# Altium project X98_CARRIER_V1R2.PrjPcb (part 1 of 3)
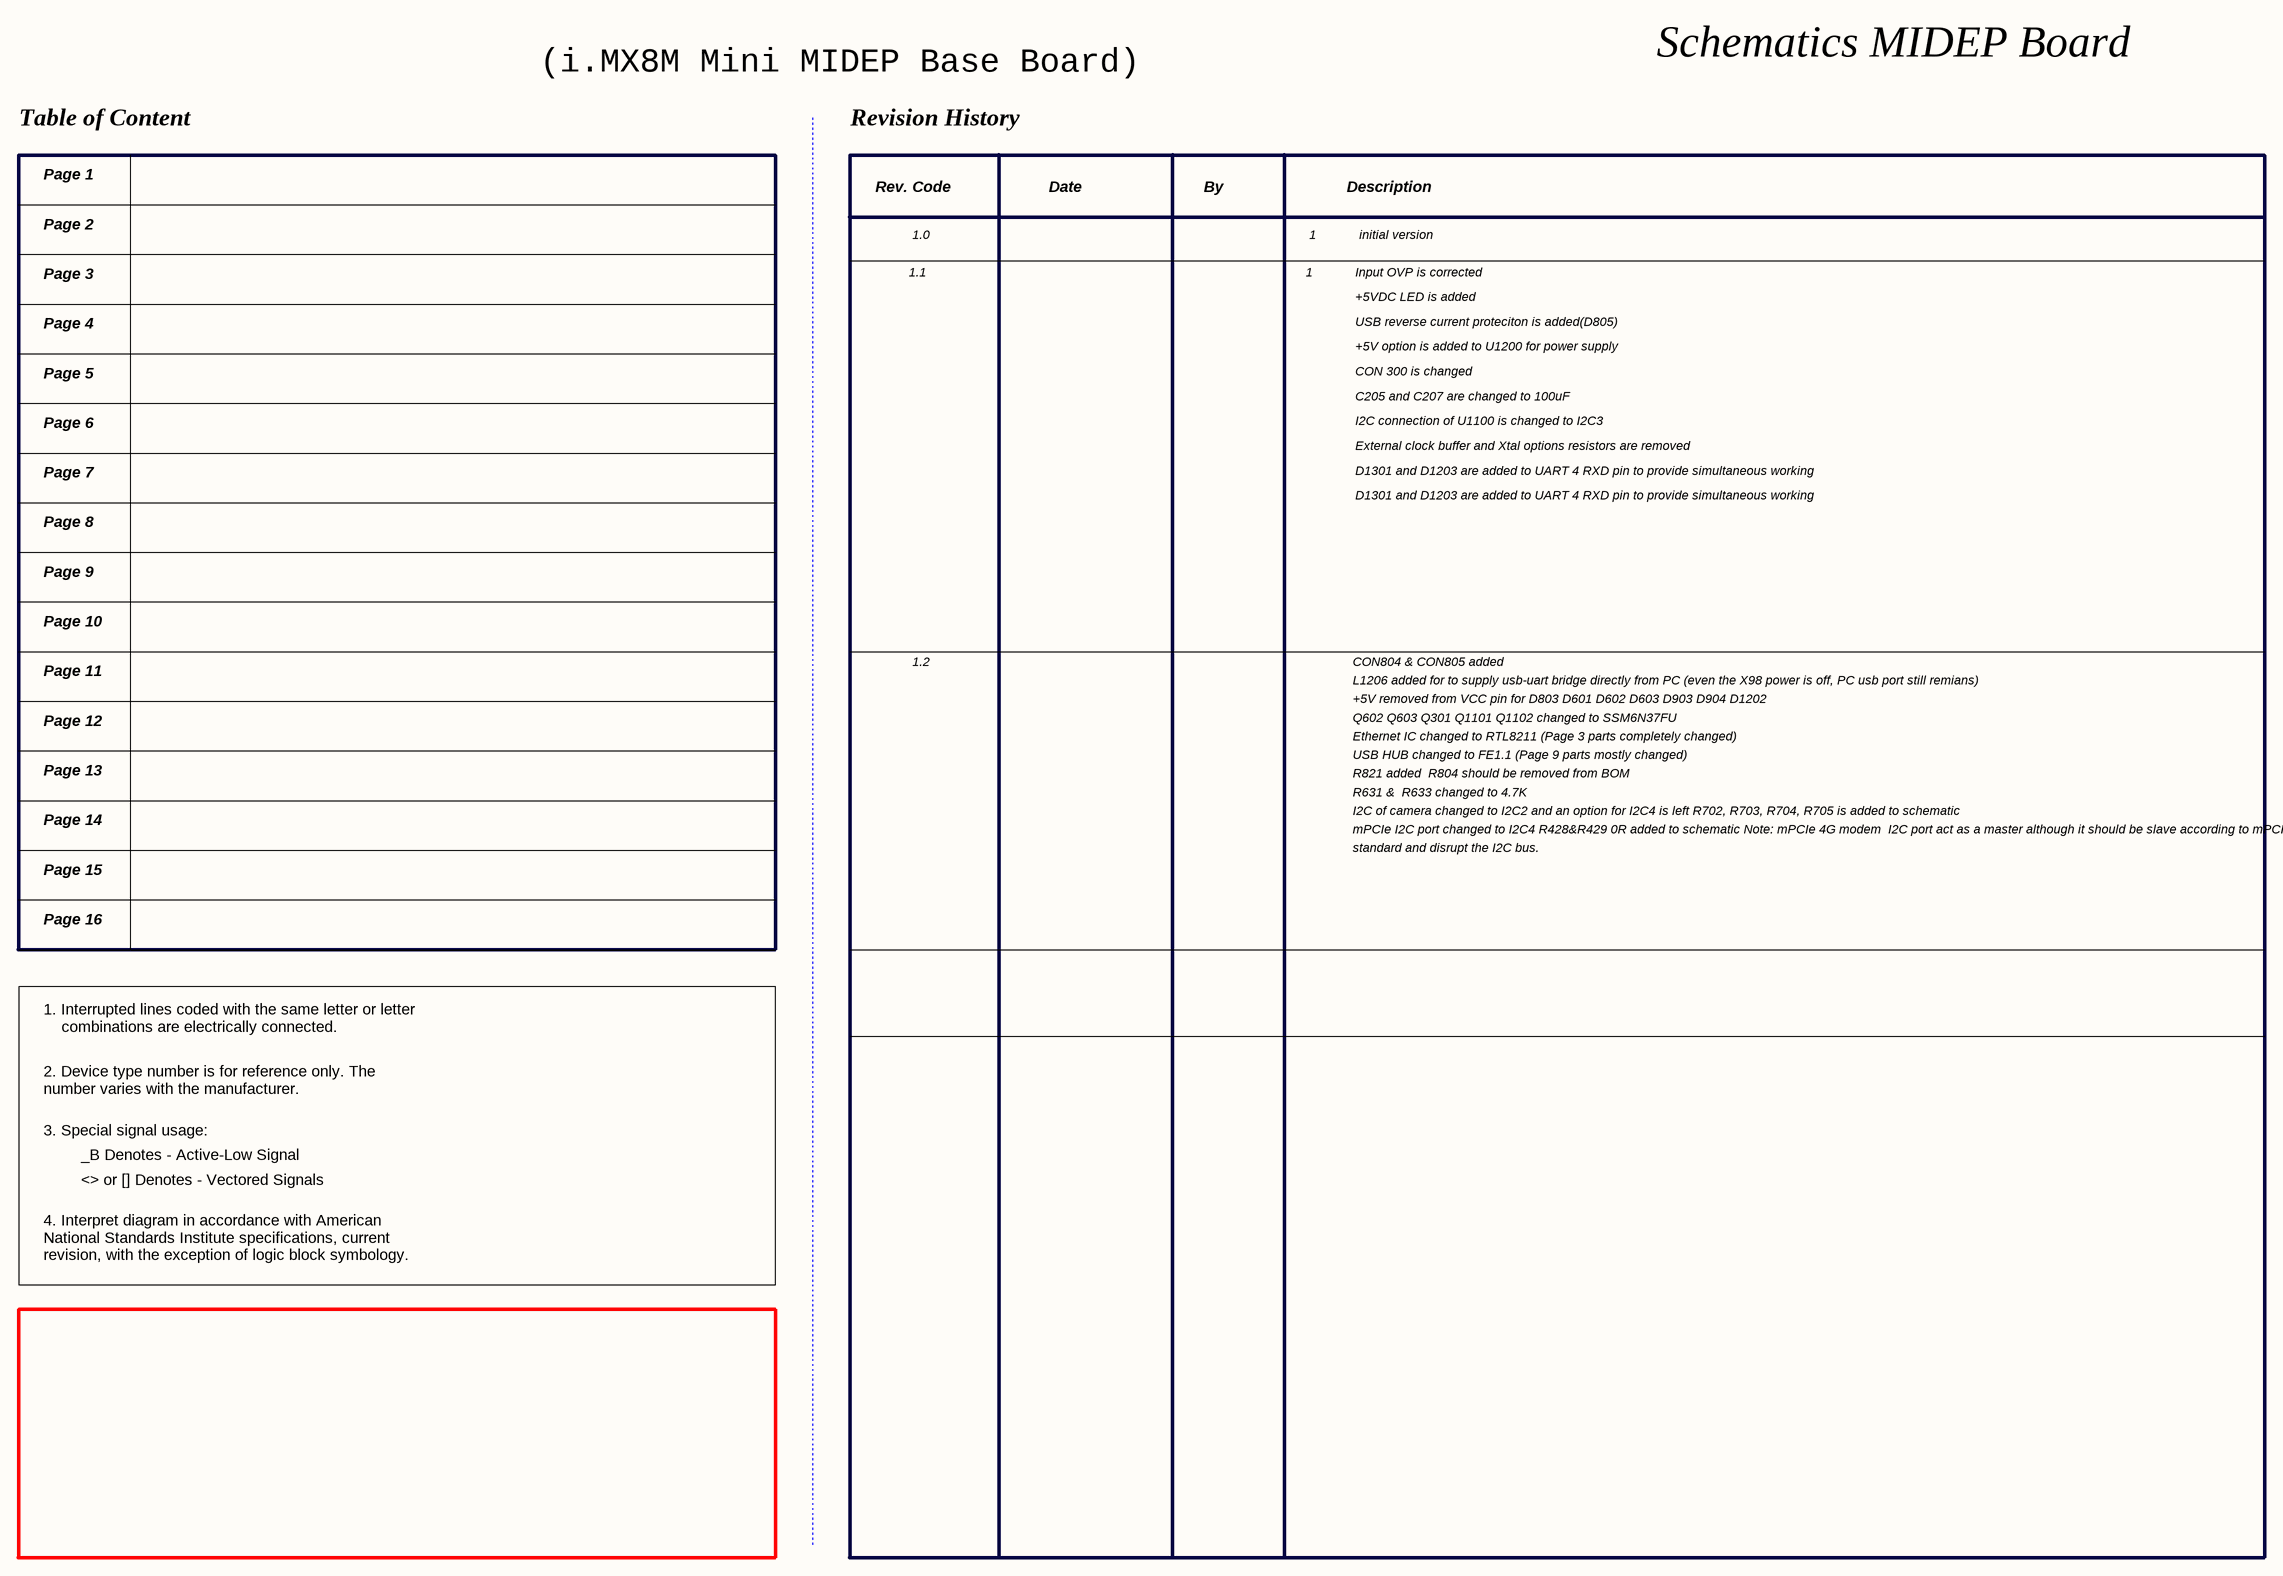
[diagram p0: 00 COVER.SchDoc]
13 sheets, 358 parts. Net scope: global (net labels, ports and power ports of the same name join across sheets).
Board file: X98_CARRIER_V1R2_12082022.PcbDoc
Sheets:
  00 COVER.SchDoc
  00 BLOCK DIAGRAM.SchDoc
  MAIN.SchDoc
    U_05 MICROSD = 05 MICROSD.SchDoc
    U_06 MIPI-DSI to HDMI = 06 MIPI-DSI to HDMI.SchDoc
    U_07 MIPI CSI = 07 MIPI CSI.SchDoc
    U_08 USB OTG & POWER = 08 USB OTG & POWER.SchDoc
    U_09 USB HUB = 09 USB HUB.SchDoc
    U_10 BOOT = 10 BOOT.SchDoc
    U_11 EXPANSION CN = 11 EXPANSION CN.SchDoc
    U_12 CONSOLE = 12 CONSOLE.SchDoc
    U_01 SoM IO INTERFACE = 01 SoM IO INTERFACE.SchDoc
  00 PCB SPEC.SchDoc

## Sheet 00 COVER.SchDoc
size A2

### Notes on the sheet
- (i.MX8M Mini MIDEP Base Board)
- Schematics MIDEP Board
- Table of Content
- Revision History
- Page 1
- Rev. Code
- Date
- By
- Description
- Page 2
- 1.0
- 1
- initial version
- Page 3
- Page 4
- 1.1
- Input OVP is corrected
- +5VDC LED is added
- USB reverse current proteciton is added(D805)
- Page 5
- +5V option is added to U1200 for power supply
- CON 300 is changed
- Page 6
- C205 and C207 are changed to 100uF
- I2C connection of U1100 is changed to I2C3
- External clock buffer and Xtal options resistors are removed
- Page 7
- D1301 and D1203 are added to UART 4 RXD pin to provide simultaneous working
- Page 8
- Page 9
- Page 10
- Page 11
- 1.2
- CON804 & CON805 added
- L1206 added for to supply usb-uart bridge directly from PC (even the X98 power is off, PC usb port still remians)
- +5V removed from VCC pin for D803 D601 D602 D603 D903 D904 D1202
- Page 12
- Q602 Q603 Q301 Q1101 Q1102 changed to SSM6N37FU
- Ethernet IC changed to RTL8211 (Page 3 parts completely changed)
- USB HUB changed to FE1.1 (Page 9 parts mostly changed)
- Page 13
- Page 14
- R821 added  R804 should be removed from BOM
- R631 &  R633 changed to 4.7K
- I2C of camera changed to I2C2 and an option for I2C4 is left R702, R703, R704, R705 is added to schematic
- Page 15
- mPCIe I2C port changed to I2C4 R428&R429 0R added to schematic Note: mPCIe 4G modem  I2C port act as a master although it should be slave according to mPCIe
- standard and disrupt the I2C bus.
- Page 16
- 1. Interrupted lines coded with the same letter or letter
  combinations are electrically connected.
- 2. Device type number is for reference only. The
  number varies with the manufacturer.
- 3. Special signal usage:
- _B Denotes - Active-Low Signal
- <> or [] Denotes - Vectored Signals
- 4. Interpret diagram in accordance with American
  National Standards Institute specifications, current
  revision, with the exception of logic block symbology.
- Sheet Title:
- Project:
- Inventron
- Electronics and Software
- Size:
- Date:
- Drawn By:
- Revision:
- Checked By:
- A4
- Sheet
- Time:
- of
- Budotek Teknopark
- Dudullu OSB
- Des 2. Cadde No:8/30
- ©2020 Inventron Electronics and Software. All rights reserved.
- Umraniye / ISTANBUL

## Sheet 00 BLOCK DIAGRAM.SchDoc
size A3
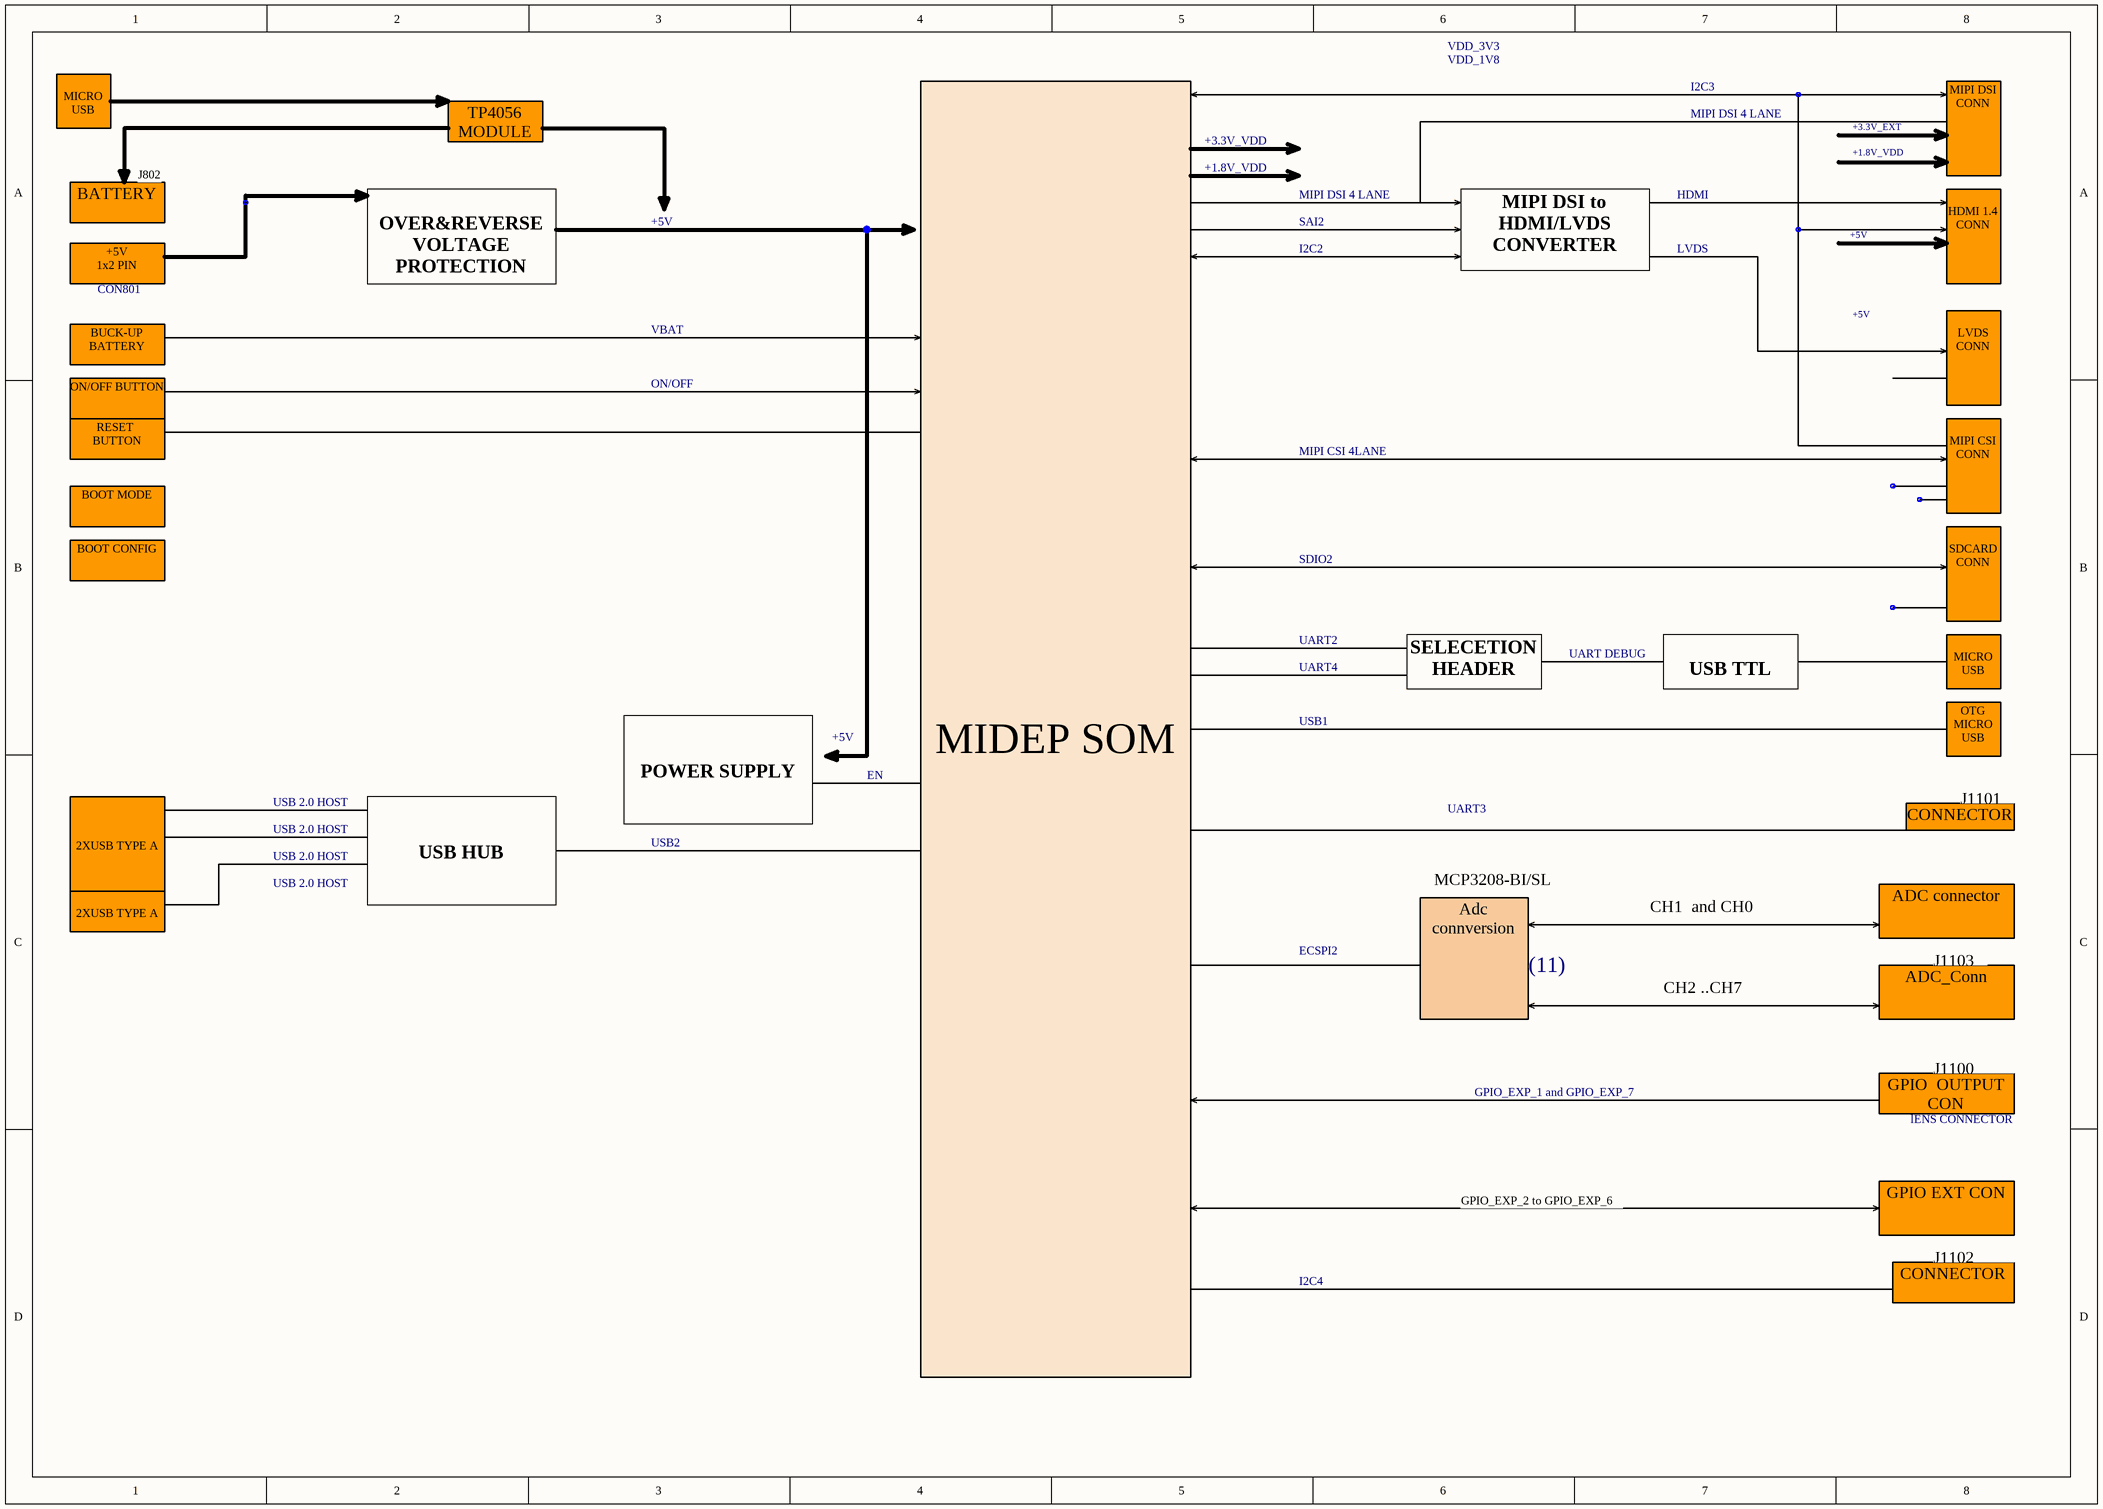
[diagram p1: 00 BLOCK DIAGRAM.SchDoc]

### Notes on the sheet
- VDD_3V3
- VDD_1V8
- I2C3
- MICRO USB
- J802
- TP4056
  MODULE
- +3.3V_VDD
- +1.8V_VDD
- MIPI DSI 4 LANE
- +3.3V_EXT
- MIPI DSI CONN
- BATTERY
- +5V
- SAI2
- HDMI
- +5V
  1x2 PIN
- CON801
- OVER&REVERSE VOLTAGE
  PROTECTION
- I2C2
- MIPI DSI to HDMI/LVDS CONVERTER
- LVDS
- HDMI 1.4 CONN
- BUCK-UP BATTERY
- VBAT
- ON/OFF BUTTON
- ON/OFF
- LVDS CONN
- RESET
  BUTTON
- MIPI CSI 4LANE
- MIPI CSI CONN
- BOOT MODE
- BOOT CONFIG
- SDIO2
- UART2
- SDCARD CONN
- UART4
- SELECETION HEADER
- UART DEBUG
- USB TTL
- EN
- USB1
- OTG
  MICRO USB
- USB 2.0 HOST
- POWER SUPPLY
- USB2
- UART3
- CONNECTOR
- J1101
- 2XUSB TYPE A
- USB HUB
- MCP3208-BI/SL
- CH1  and CH0
- ECSPI2
- (11)
- CH2 ..CH7
- ADC connector
- J1103
- Adc connversion
- ADC_Conn
- GPIO_EXP_1 and GPIO_EXP_7
- GPIO  OUTPUT CON
- lENS CONNECTOR
- J1100
- GPIO_EXP_2 to GPIO_EXP_6
- GPIO EXT CON
- J1102
- I2C4
- MIDEP SOM
- Sheet Title:
- Inventron
- Size:
- Drawn By:
- Revision:
- Project:
- Checked By:
- A4
- Sheet
- of
- Budotek Teknopark
- Dudullu OSB
- Des 2. Cadde No:8/30
- Umraniye / ISTANBUL
- Electronics and Software
- Date:
- Time:
- ©2020 Inventron Electronics and Software. All rights reserved.

## Sheet MAIN.SchDoc
size A3
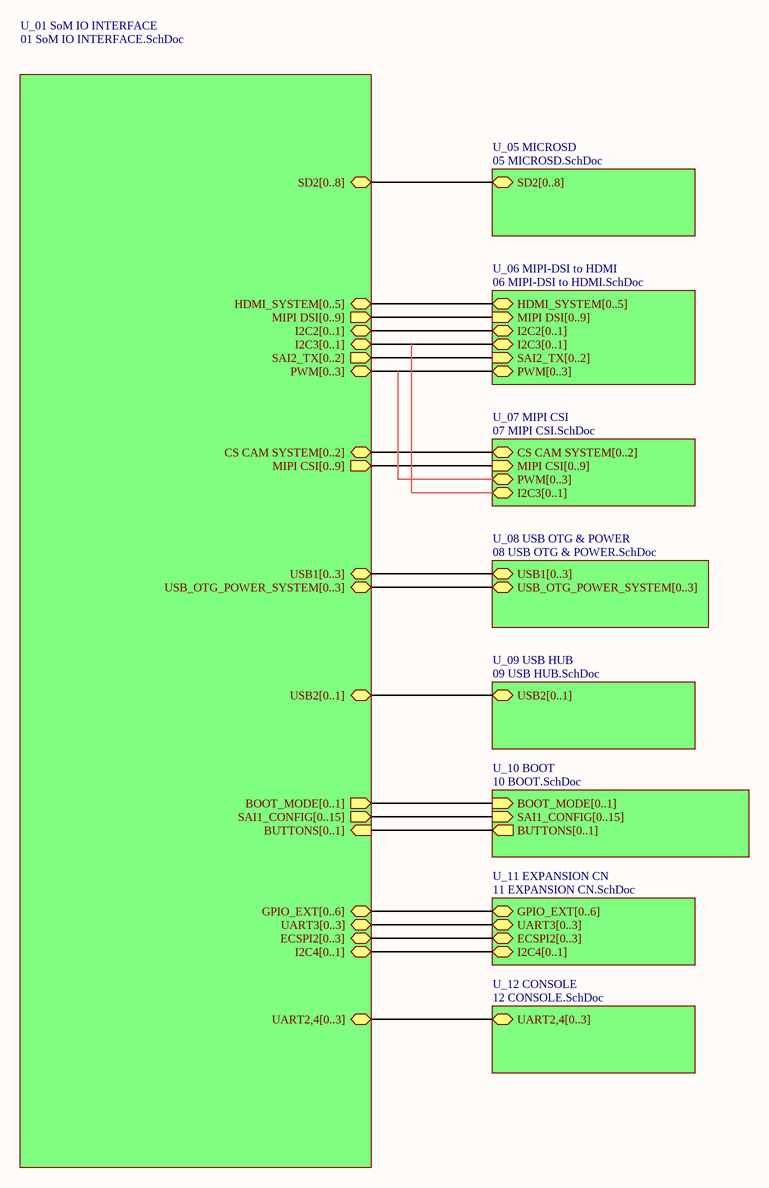
[diagram p2: MAIN.SchDoc]

### Sub-sheets
U_01 SoM IO INTERFACE = 01 SoM IO INTERFACE.SchDoc: MIPI DSI[0..9] (out), MIPI CSI[0..9] (out), USB1[0..3] (bidir), USB2[0..1] (bidir), UART3[0..3] (bidir), ECSPI2[0..3] (bidir), I2C2[0..1] (bidir), I2C3[0..1] (bidir), I2C4[0..1] (bidir), SD2[0..8] (bidir), PWM[0..3] (bidir), GPIO_EXT[0..6] (bidir), SAI1_CONFIG[0..15] (out), BUTTONS[0..1] (in), CS CAM SYSTEM[0..2] (bidir), USB_OTG_POWER_SYSTEM[0..3] (bidir), HDMI_SYSTEM[0..5] (bidir), BOOT_MODE[0..1] (out), UART2,4[0..3] (bidir), SAI2_TX[0..2] (out)
U_05 MICROSD = 05 MICROSD.SchDoc: SD2[0..8] (bidir)
U_06 MIPI-DSI to HDMI = 06 MIPI-DSI to HDMI.SchDoc: HDMI_SYSTEM[0..5] (bidir), MIPI DSI[0..9] (in), I2C2[0..1] (bidir), I2C3[0..1] (bidir), SAI2_TX[0..2] (in), PWM[0..3] (bidir)
U_07 MIPI CSI = 07 MIPI CSI.SchDoc: CS CAM SYSTEM[0..2] (bidir), MIPI CSI[0..9] (in), PWM[0..3] (bidir), I2C3[0..1] (bidir)
U_08 USB OTG & POWER = 08 USB OTG & POWER.SchDoc: USB1[0..3] (bidir), USB_OTG_POWER_SYSTEM[0..3] (bidir)
U_09 USB HUB = 09 USB HUB.SchDoc: USB2[0..1] (bidir)
U_10 BOOT = 10 BOOT.SchDoc: BUTTONS[0..1] (out), BOOT_MODE[0..1] (in), SAI1_CONFIG[0..15] (in)
U_11 EXPANSION CN = 11 EXPANSION CN.SchDoc: GPIO_EXT[0..6] (bidir), UART3[0..3] (bidir), ECSPI2[0..3] (bidir), I2C4[0..1] (bidir)
U_12 CONSOLE = 12 CONSOLE.SchDoc: UART2,4[0..3] (bidir)

### Notes on the sheet
- Sheet Title:
- Inventron
- Size:
- Drawn By:
- Revision:
- Project:
- Checked By:
- A4
- Sheet
- of
- Budotek Teknopark
- Dudullu OSB
- Des 2. Cadde No:8/30
- Umraniye / ISTANBUL
- Electronics and Software
- Date:
- Time:
- ©2020 Inventron Electronics and Software. All rights reserved.

## Sheet 05 MICROSD.SchDoc
size A4
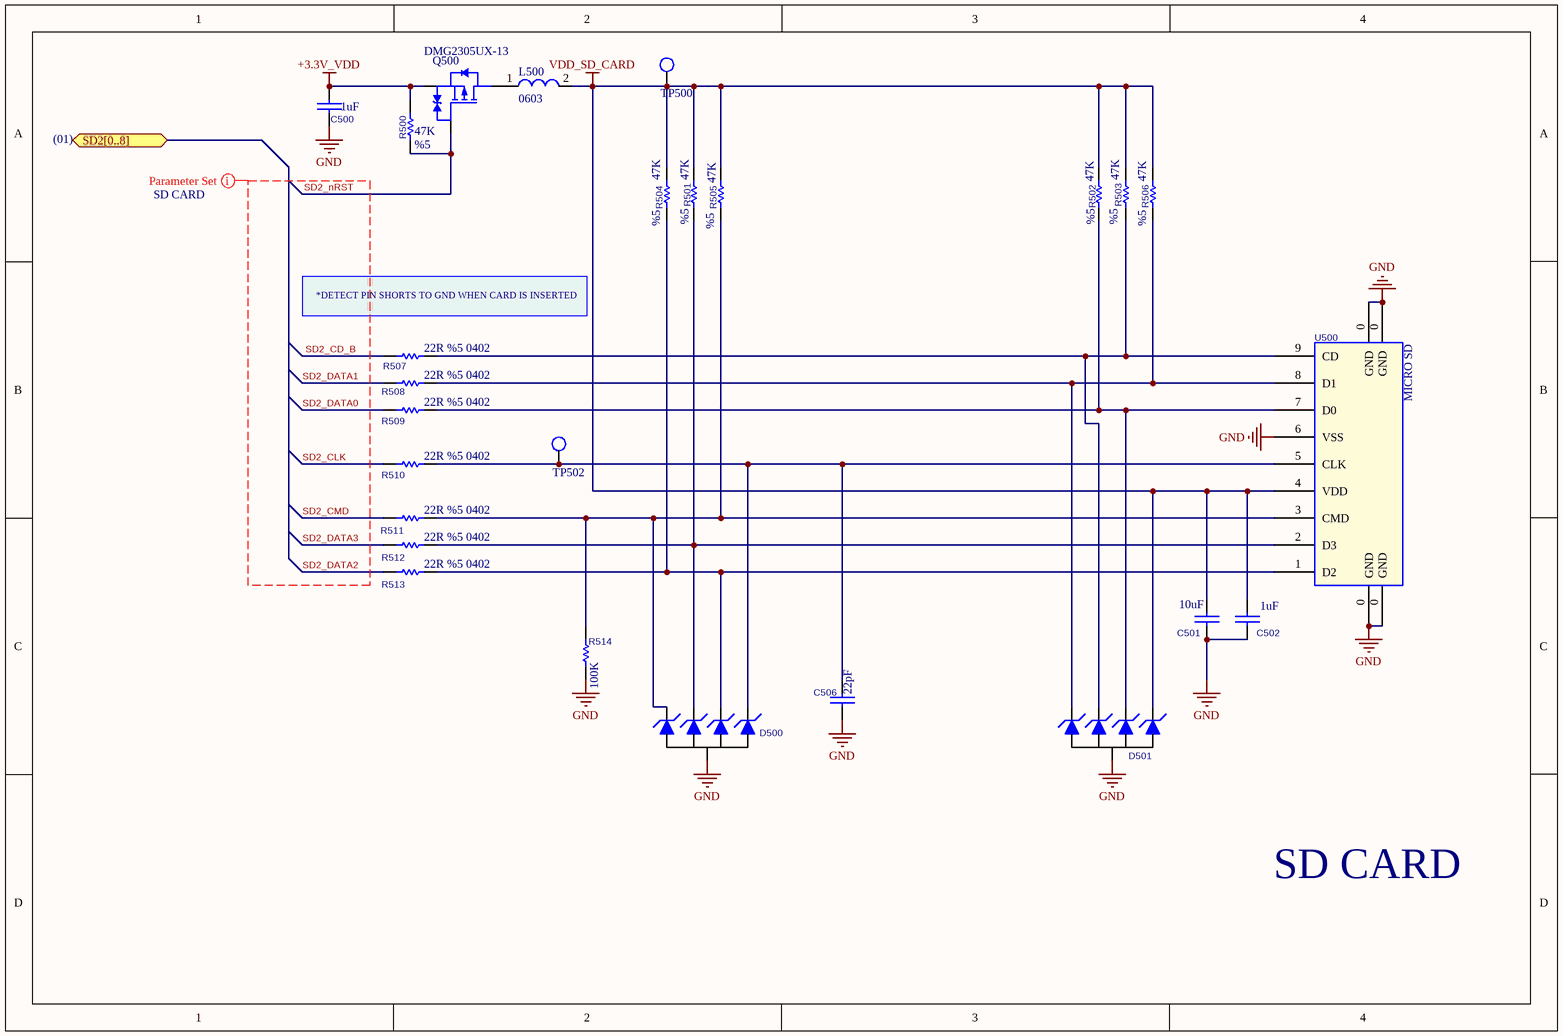
[diagram p3: 05 MICROSD.SchDoc]

### Parts
C500  1uF  [0603_CC]
C501  10uF  [0603_CC]
C502  1uF  [0603_CC]
C506  22pF  [0402_CC]
D500  DIODE-DF5A6.2LJE,LM  [DF5A6.2LJE,LM]  (value not drawn)
D501  DIODE-DF5A6.2LJE,LM  [DF5A6.2LJE,LM]  (value not drawn)
L500  0603  [0603_RES]
Q500  DMG2305UX-13  [SOT23]
R500  47K  Tolerance: %5  [0402_RES]
R501  47K  Tolerance: %5  [0402_RES]
R502  47K  Tolerance: %5  [0402_RES]
R503  47K  Tolerance: %5  [0402_RES]
R504  47K  Tolerance: %5  [0402_RES]
R505  47K  Tolerance: %5  [0402_RES]
R506  47K  Tolerance: %5  [0402_RES]
R507  22R %5 0402  [0402_RES]
R508  22R %5 0402  [0402_RES]
R509  22R %5 0402  [0402_RES]
R510  22R %5 0402  [0402_RES]
R511  22R %5 0402  [0402_RES]
R512  22R %5 0402  [0402_RES]
R513  22R %5 0402  [0402_RES]
R514  100K  [0402_RES]
TP500  TEST POINT 15  [testpoint_15]  (value not drawn)  (no BOM)
TP502  TEST POINT 15  [testpoint_15]  (value not drawn)  (no BOM)
U500  MICRO SD  [L-KLS1-TF-003-H1.85-R]

### Ports
SD2[0..8] (bidir)

### Nets
+3.3V_VDD: C500.1 Q500.2(S) R500.2
GND: C500.2 C501.2 C502.2 C506.2 D500.2 D501.2 R514.1 U500.0(GND) U500.6(VSS)
VDD_SD_CARD: C501.1 C502.1 D501.5 L500.2 R501.2 R502.2 R503.2 R504.2 R505.2 R506.2 TP500.1 U500.4(VDD)
SD2_CD_B: R507.1
SD2_CLK: R510.1
SD2_CMD: R511.1
SD2_DATA0: R509.1
SD2_DATA1: R508.1
SD2_DATA2: R513.1
SD2_DATA3: R512.1
SD2_nRST: Q500.1(G) R500.1
NetC506_1: C506.1 D500.5 R510.2 TP502.1 U500.5(CLK)
NetD500_1: D500.1 R505.1 R511.2 R514.2 U500.3(CMD)
NetD500_3: D500.3 R501.1 R512.2 U500.2(D3)
NetD500_4: D500.4 R504.1 R513.2 U500.1(D2)
NetD501_1: D501.1 R506.1 R508.2 U500.8(D1)
NetD501_3: D501.3 R503.1 R507.2 U500.9(CD)
NetD501_4: D501.4 R502.1 R509.2 U500.7(D0)
NetL500_1: L500.1 Q500.3(D)

### Layout directives
net class SD CARD: SD2_CD_B, SD2_CLK, SD2_CMD, SD2_DATA0, SD2_DATA1, SD2_DATA2, SD2_DATA3, SD2_nRST

### Notes on the sheet
- (01)
- *DETECT PIN SHORTS TO GND WHEN CARD IS INSERTED
- SD CARD
- Sheet Title:
- Inventron
- Size:
- Drawn By:
- Revision:
- Project:
- Checked By:
- A4
- Sheet
- of
- Budotek Teknopark
- Dudullu OSB
- Des 2. Cadde No:8/30
- Umraniye / ISTANBUL
- Electronics and Software
- Date:
- Time:
- ©2020 Inventron Electronics and Software. All rights reserved.

### Library data of the parts
C500 C502 = CAP-CL10B105KA8NNNC: CAP CER 1UF 25V X7R 0603; Manufacturer-1: SAMSUNG; Class: Capacitor; Manufacturer Part Number-1: CL10B105KA8NNNC; Footprint: *; Manufacturer-2: *; Manufacturer Part Number-2: *; Inventron Stock No: *; Created By: LA; Created Date: *; Checked By: *; ASSY_OPT: *; Dimensions: *; Unit Price: *; Revision Date/Note: *; Price Break: *; Opt. Temp.: *; Features: *
C501 = CAP-JMK107BC6106MA-T: CAP CER 10UF 6.3V X6S 0603; Manufacturer-1: TAIYO YUDEN; Opt. Temp.: -55/+105; Class: Capacitor; Manufacturer Part Number-1: JMK107BC6106MA-T; Footprint: 0603; Manufacturer-2: *; Manufacturer Part Number-2: *; Inventron Stock No: *; Created By: LA; Created Date: 23.11.2018; Checked By: *; ASSY_OPT: *; Dimensions: *; Unit Price: 0,044; Revision Date/Note: *; Price Break: 4K
C506 = CAP-C0402C220K5GACTU: CAP CER 22PF 50V C0G/NPO 0402; Manufacturer-1: KEMET; Opt. Temp.: -55/+125; Class: Capacitor; Manufacturer Part Number-1: C0402C220K5GACTU; Footprint: 0402; Manufacturer-2: *; Manufacturer Part Number-2: *; Inventron Stock No: *; Created By: LA; Created Date: 23.11.2018; Checked By: *; ASSY_OPT: *; Dimensions: *; Unit Price: 0,00420; Revision Date/Note: *; Price Break: 10K
D500 D501 = DIODE-DF5A6.2LJE,LM: TVS DIODE 5V 4CH SOT-553; Manufacturer-1: TOSHIBA; Manufacturer Part Number-1: DF5A6.2LJE,LM; Footprint: *; Manufacturer-2: *; Manufacturer Part Number-2: *; Inventron Stock No: *; Created By: OKS; Created Date: 29.03.2019; Checked By: *; ASSY_OPT: *; Dimensions: *; Unit Price: *; Revision Date/Note: *; Price Break: *; Opt. Temp.: *; Class: Diode
L500 = IND-FERRITE (RES 0 OHM) 0603: 0OHM 0603; Manufacturer Part Number-1: RC0603JR-070RL; Manufacturer-1: YAGEO; Class: Inductor; Footprint: 0603; Manufacturer-2: *; Inventron Stock No: *; Created By: EE; Checked By: *; ASSY_OPT: *; Dimensions: *; Revision Date/Note: *
Q500 = MOS-DMG2305UX-13: MOSFET P-CH 20V 4.2A SOT23; Manufacturer-1: Diodes Incorporated; Class: Transistor; Manufacturer Part Number-1: DMG2305UX-13; Manufacturer-2: *; Manufacturer Part Number-2: *; Inventron Stock No: *; Created By: EE; Created Date: *; Checked By: *; ASSY_OPT: *; Dimensions: *; Unit Price: 0.072D; Revision Date/Note: *; Price Break: *; Opt. Temp.: *; Features: *
R500-R506 = RES-47K: RES 47K OHM 5% 1/16W 0402; Manufacturer Part Number-1: MCR01MZPJ473; Opt. Temp.: -55/+155; Class: Resistor; Footprint: 0402; Manufacturer-2: *; Manufacturer Part Number-2: *; Inventron Stock No: *; Created By: LA; Checked By: *; ASSY_OPT: *; Dimensions: *; Revision Date/Note: *
R507-R513 = RES- RC0402JR-0722RL.: RES, THICK FILM, 22R, 5%, 0.0625W, 0402, REEL; Manufacturer-1: YAGEO; Class: Resistor; Manufacturer Part Number-1: RC0402JR-0722RL.; Footprint: 0402; Manufacturer-2: *; Manufacturer Part Number-2: *; Inventron Stock No: *; Created By: E.E; Created Date: 22.10.2020; Checked By: *; ASSY_OPT: *; Dimensions: *; Unit Price: *; Revision Date/Note: *; Price Break: *; Opt. Temp.: *; Tolerance: *
R514 = RES-RMCF0402JT100K: RES 100K OHM 5% 1/16W 0402; Manufacturer-1: STACKPOLE; Opt. Temp.: -55/+155; Class: Resistor; Tolerance: %5; Manufacturer Part Number-1: RMCF0402JT100K; Footprint: 0402; Manufacturer-2: *; Manufacturer Part Number-2: *; Inventron Stock No: *; Created By: LA; Created Date: 23.11.2018; Checked By: *; ASSY_OPT: *; Dimensions: *; Unit Price: 0,00127; Revision Date/Note: *; Price Break: 10K; Features: AUTOMOTIVE
U500 = CON-L-KLS1-TF-003-H1.85-R: CONECTOR MICRO SD CARD SMD KLS; Opt. Temp.: -25/+90; Class: Connector; Manufacturer Part Number-1: L-KLS1-TF-003-H1.85-R; Footprint: *; Manufacturer-1: KLS; Manufacturer-2: *; Manufacturer Part Number-2: *; Inventron Stock No: *; Created By: LA; Created Date: 19.04.2019; Checked By: *; ASSY_OPT: *; Dimensions: *; Unit Price: 0,2299; Revision Date/Note: *; Price Break: 1000

## Sheet 06 MIPI-DSI to HDMI.SchDoc
size A2
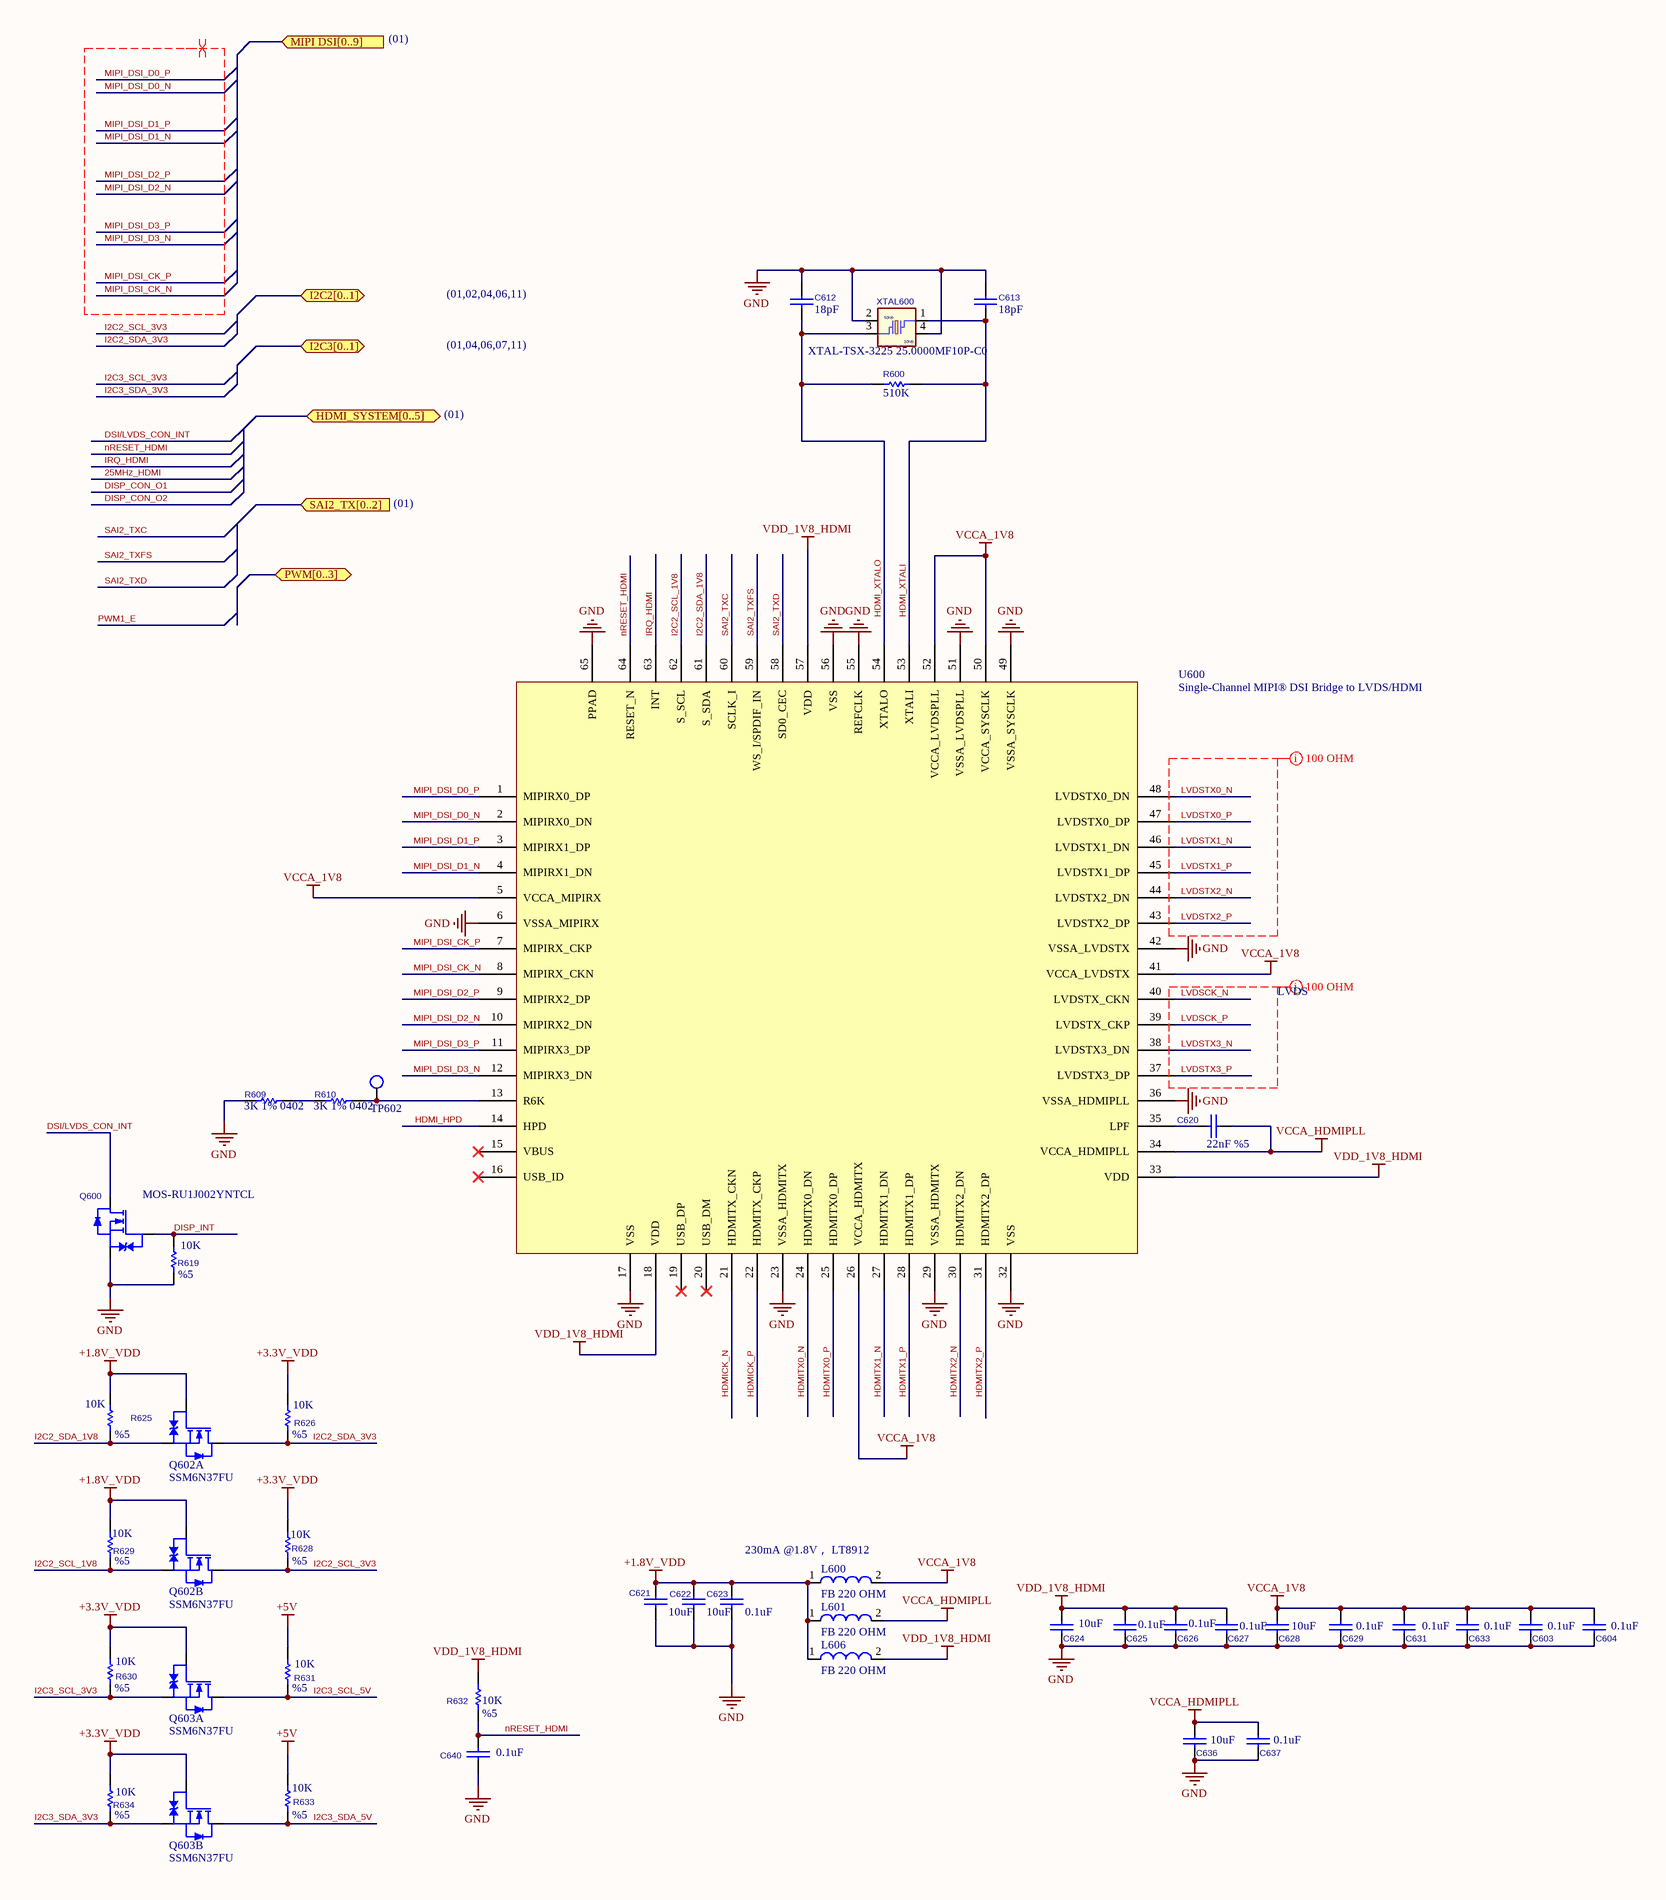
[diagram p4: 06 MIPI-DSI to HDMI.SchDoc, left]
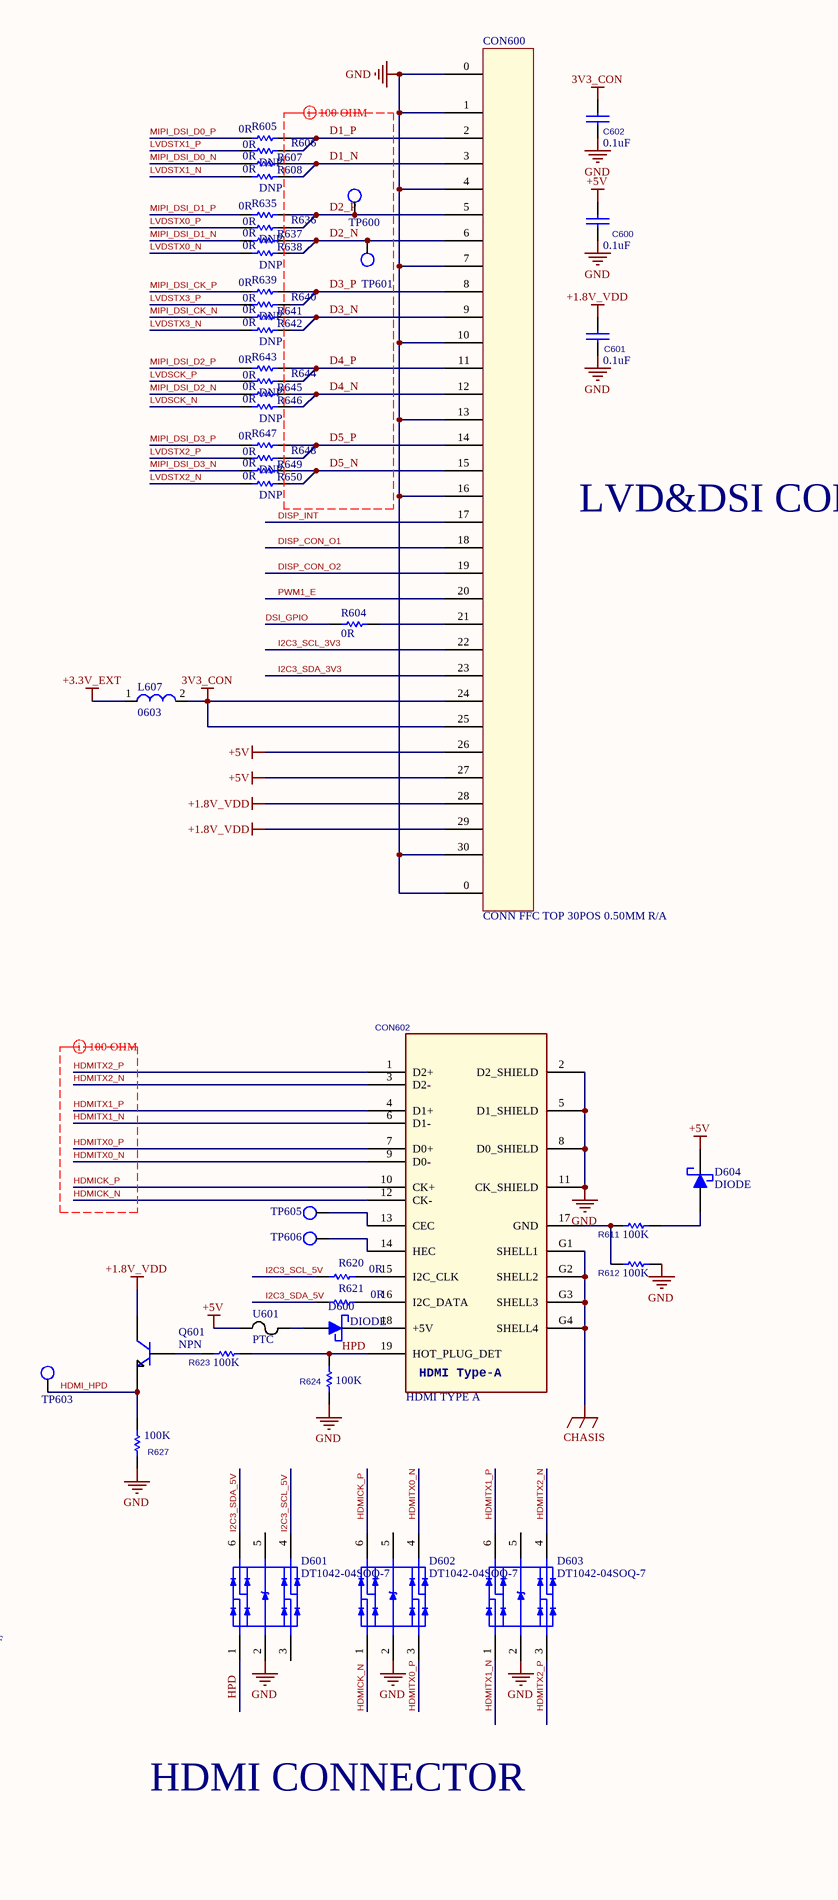
[diagram p5: 06 MIPI-DSI to HDMI.SchDoc, right]

### Parts
C600  0.1uF  [0402_CC]
C601  0.1uF  [0402_CC]
C602  0.1uF  [0402_CC]
C603  0.1uF  [0402_CC]
C604  0.1uF  [0402_CC]
C612  18pF  [0402_CC]
C613  18pF  [0402_CC]
C620  22nF %5  [0603_CC]
C621  10uF  [0603_CC]
C622  10uF  [0603_CC]
C623  0.1uF  [0402_CC]
C624  10uF  [0603_CC]
C625  0.1uF  [0402_CC]
C626  0.1uF  [0402_CC]
C627  0.1uF  [0402_CC]
C628  10uF  [0603_CC]
C629  0.1uF  [0402_CC]
C631  0.1uF  [0402_CC]
C633  0.1uF  [0402_CC]
C636  10uF  [0603_CC]
C637  0.1uF  [0402_CC]
C640  0.1uF  [0402_CC]
CON600  CONN FFC TOP 30POS 0.50MM R/A  [CON-SFV30R-2STBE1HLF]
CON602  HDMI TYPE A  [CON-L-KLS1-285-1-N-1]
D600  DIODE  [SOD-323]
D601  DT1042-04SOQ-7  [DIODE-DT1042-04SOQ-7]
D602  DT1042-04SOQ-7  [DIODE-DT1042-04SOQ-7]
D603  DT1042-04SOQ-7  [DIODE-DT1042-04SOQ-7]
D604  DIODE  [SOD-323]
L600  FB 220 OHM  [0603_RES]
L601  FB 220 OHM  [0603_RES]
L606  FB 220 OHM  [0603_RES]
L607  0603  [0603_RES]
Q600  MOS-RU1J002YNTCL  [SC-85-3/SOT-323FL]
Q601  NPN  [SOT23]
Q602  SSM6N37FU  [SOT-363]  (parts A,B of 2)
Q603  SSM6N37FU  [SOT-363]  (parts A,B of 2)
R600  510K  [0402_RES]
R604  0R  [0402_RES]
R605  0R  ASSY_OPT: DNP  [0402_RES]  (no BOM)
R606  0R  [0402_RES]
R607  0R  ASSY_OPT: DNP  [0402_RES]  (no BOM)
R608  0R  [0402_RES]
R609  3K 1% 0402  [0402_RES]
R610  3K 1% 0402  [0402_RES]
R611  100K  [0402_RES]
R612  100K  [0402_RES]
R619  10K  Tolerance: %5  [0402_RES]
R620  0R  [0402_RES]
R621  0R  [0402_RES]
R623  100K  [0402_RES]
R624  100K  [0402_RES]
R625  10K  Tolerance: %5  [0402_RES]
R626  10K  Tolerance: %5  [0402_RES]
R627  100K  [0402_RES]
R628  10K  Tolerance: %5  [0402_RES]
R629  10K  Tolerance: %5  [0402_RES]
R630  10K  Tolerance: %5  [0402_RES]
R631  10K  Tolerance: %5  [0402_RES]
R632  10K  Tolerance: %5  [0402_RES]
R633  10K  Tolerance: %5  [0402_RES]
R634  10K  Tolerance: %5  [0402_RES]
R635  0R  ASSY_OPT: DNP  [0402_RES]  (no BOM)
R636  0R  [0402_RES]
R637  0R  ASSY_OPT: DNP  [0402_RES]  (no BOM)
R638  0R  [0402_RES]
R639  0R  ASSY_OPT: DNP  [0402_RES]  (no BOM)
R640  0R  [0402_RES]
R641  0R  ASSY_OPT: DNP  [0402_RES]  (no BOM)
R642  0R  [0402_RES]
R643  0R  ASSY_OPT: DNP  [0402_RES]  (no BOM)
R644  0R  [0402_RES]
R645  0R  ASSY_OPT: DNP  [0402_RES]  (no BOM)
R646  0R  [0402_RES]
R647  0R  ASSY_OPT: DNP  [0402_RES]  (no BOM)
R648  0R  [0402_RES]
R649  0R  ASSY_OPT: DNP  [0402_RES]  (no BOM)
R650  0R  [0402_RES]
TP600  TEST POINT 15  [testpoint_15]  (value not drawn)  (no BOM)
TP601  TEST POINT 15  [testpoint_15]  (value not drawn)  (no BOM)
TP602  TEST POINT 15  [testpoint_15]  (value not drawn)  (no BOM)
TP603  TEST POINT 15  [testpoint_15]  (value not drawn)  (no BOM)
TP605  TEST POINT 35  [testpoint_35mil]  (value not drawn)  (no BOM)
TP606  TEST POINT 35  [testpoint_35mil]  (value not drawn)  (no BOM)
U600  Single-Channel MIPI® DSI Bridge to LVDS/HDMI  [IC-LT8912B]
U601  PTC  [0ZCJ0025AF2E]
XTAL600  XTAL-TSX-3225 25.0000MF10P-C0  [XTLOSC4_3P2X2P5MM_SM]

### Ports
HDMI_SYSTEM[0..5] (bidir), I2C2[0..1] (bidir), I2C3[0..1] (bidir), MIPI DSI[0..9] (in), PWM[0..3] (bidir), SAI2_TX[0..2] (in)

### Nets
3V3_CON: C602.1 CON600.24 CON600.25 L607.2
+1.8V_VDD: C601.1 C621.1 C622.1 C623.1 CON600.28 CON600.29 L600.1 L601.1 L606.1 Q601.3(C) Q602.2(G) Q602.5(G) R625.2 R629.2
+3.3V_EXT: L607.1
+3.3V_VDD: Q603.2(G) Q603.5(G) R626.2 R628.2 R630.2 R634.2
+5V: C600.1 CON600.26 CON600.27 D604.K R631.2 R633.2 U601.1
CHASIS: CON602.G1(SHELL1) CON602.G2(SHELL2) CON602.G3(SHELL3) CON602.G4(SHELL4)
GND: C600.2 C601.2 C602.2 C603.2 C604.2 C612.2 C613.2 C621.2 C622.2 C623.2 C624.2 C625.2 C626.2 C627.2 C628.2 C629.2 C631.2 C633.2 C636.2 C637.2 C640.2 CON600.0 CON600.1 CON600.4 CON600.7 CON600.10 CON600.13 CON600.16 CON600.30 CON602.2(D2_SHIELD) CON602.5(D1_SHIELD) CON602.8(D0_SHIELD) CON602.11(CK_SHIELD) D601.2(VSS) D602.2(VSS) D603.2(VSS) Q600.2(S) R609.1 R612.2 R619.1 R624.1 R627.1 U600.6(VSSA_MIPIRX) U600.17(VSS) U600.23(VSSA_HDMITX) U600.29(VSSA_HDMITX) U600.32(VSS) U600.36(VSSA_HDMIPLL) U600.42(VSSA_LVDSTX) U600.49(VSSA_SYSCLK) U600.51(VSSA_LVDSPLL) U600.55(REFCLK) U600.56(VSS) U600.65(PPAD) XTAL600.2(GND1) XTAL600.4(GND2)
VCCA_1V8: C603.1 C604.1 C628.1 C629.1 C631.1 C633.1 L600.2 U600.5(VCCA_MIPIRX) U600.26(VCCA_HDMITX) U600.41(VCCA_LVDSTX) U600.50(VCCA_SYSCLK) U600.52(VCCA_LVDSPLL)
VCCA_HDMIPLL: C620.2 C636.1 C637.1 L601.2 U600.34(VCCA_HDMIPLL)
VDD_1V8_HDMI: C624.1 C625.1 C626.1 C627.1 L606.2 R632.2 U600.18(VDD) U600.33(VDD) U600.57(VDD)
D1_N: CON600.3 R607.2 R608.2
D1_P: CON600.2 R605.2 R606.2
D2_N: CON600.6 R637.2 R638.2 TP601.1
D2_P: CON600.5 R635.2 R636.2 TP600.1
D3_N: CON600.9 R641.2 R642.2
D3_P: CON600.8 R639.2 R640.2
D4_N: CON600.12 R645.2 R646.2
D4_P: CON600.11 R643.2 R644.2
D5_N: CON600.15 R649.2 R650.2
D5_P: CON600.14 R647.2 R648.2
DISP_CON_O1: CON600.18
DISP_CON_O2: CON600.19
DISP_INT: CON600.17 Q600.1(G) R619.2
DSI/LVDS_CON_INT: Q600.3(D)
DSI_GPIO: R604.1
HDMI_HPD: Q601.2(E) R627.2 TP603.1 U600.14(HPD)
HDMI_XTALI: C613.1 R600.1 U600.53(XTALI) XTAL600.1
HDMI_XTALO: C612.1 R600.2 U600.54(XTALO) XTAL600.3
HDMICK_N: CON602.12(CK-) D602.1(IO1) U600.21(HDMITX_CKN)
HDMICK_P: CON602.10(CK+) D602.6(IO4) U600.22(HDMITX_CKP)
HDMITX0_N: CON602.9(D0-) D602.4(IO3) U600.24(HDMITX0_DN)
HDMITX0_P: CON602.7(D0+) D602.3(IO2) U600.25(HDMITX0_DP)
HDMITX1_N: CON602.6(D1-) D603.1(IO1) U600.27(HDMITX1_DN)
HDMITX1_P: CON602.4(D1+) D603.6(IO4) U600.28(HDMITX1_DP)
HDMITX2_N: CON602.3(D2-) D603.4(IO3) U600.30(HDMITX2_DN)
HDMITX2_P: CON602.1(D2+) D603.3(IO2) U600.31(HDMITX2_DP)
HPD: CON602.19(HOT_PLUG_DET) D601.1(IO1) R623.2 R624.2
I2C2_SCL_1V8: Q602.4(S) R629.1 U600.62(S_SCL)
I2C2_SCL_3V3: Q602.3(D) R628.1
I2C2_SDA_1V8: Q602.1(S) R625.1 U600.61(S_SDA)
I2C2_SDA_3V3: Q602.6(D) R626.1
I2C3_SCL_3V3: CON600.22 Q603.1(S) R630.1
I2C3_SCL_5V: D601.4(IO3) Q603.6(D) R620.1 R631.1
I2C3_SDA_3V3: CON600.23 Q603.4(S) R634.1
I2C3_SDA_5V: D601.6(IO4) Q603.3(D) R621.1 R633.1
IRQ_HDMI: U600.63(INT)
LVDSCK_N: R646.1 U600.40(LVDSTX_CKN)
LVDSCK_P: R644.1 U600.39(LVDSTX_CKP)
LVDSTX0_N: R638.1 U600.48(LVDSTX0_DN)
LVDSTX0_P: R636.1 U600.47(LVDSTX0_DP)
LVDSTX1_N: R608.1 U600.46(LVDSTX1_DN)
LVDSTX1_P: R606.1 U600.45(LVDSTX1_DP)
LVDSTX2_N: R650.1 U600.44(LVDSTX2_DN)
LVDSTX2_P: R648.1 U600.43(LVDSTX2_DP)
LVDSTX3_N: R642.1 U600.38(LVDSTX3_DN)
LVDSTX3_P: R640.1 U600.37(LVDSTX3_DP)
MIPI_DSI_CK_N: R641.1 U600.8(MIPIRX_CKN)
MIPI_DSI_CK_P: R639.1 U600.7(MIPIRX_CKP)
MIPI_DSI_D0_N: R607.1 U600.2(MIPIRX0_DN)
MIPI_DSI_D0_P: R605.1 U600.1(MIPIRX0_DP)
MIPI_DSI_D1_N: R637.1 U600.4(MIPIRX1_DN)
MIPI_DSI_D1_P: R635.1 U600.3(MIPIRX1_DP)
MIPI_DSI_D2_N: R645.1 U600.10(MIPIRX2_DN)
MIPI_DSI_D2_P: R643.1 U600.9(MIPIRX2_DP)
MIPI_DSI_D3_N: R649.1 U600.12(MIPIRX3_DN)
MIPI_DSI_D3_P: R647.1 U600.11(MIPIRX3_DP)
nRESET_HDMI: C640.1 R632.1 U600.64(RESET_N)
PWM1_E: CON600.20
SAI2_TXC: U600.60(SCLK_I)
SAI2_TXD: U600.58(SD0_CEC)
SAI2_TXFS: U600.59(WS_I/SPDIF_IN)
NetC620_1: C620.1 U600.35(LPF)
NetCON600_21: CON600.21 R604.2
NetCON602_13: CON602.13(CEC) TP605.1
NetCON602_14: CON602.14(HEC) TP606.1
NetCON602_15: CON602.15(I2C_CLK) R620.2
NetCON602_16: CON602.16(I2C_DATA) R621.2
NetCON602_17: CON602.17(GND) R611.1 R612.1
NetCON602_18: CON602.18(+5V) D600.K
NetD600_A: D600.A U601.2
NetD604_A: D604.A R611.2
NetQ601_1: Q601.1(B) R623.1
NetR609_2: R609.2 R610.1
NetR610_2: R610.2 TP602.1 U600.13(R6K)

Not connected (* = marked no-connect by the designer): D601 3(IO2) 5(VCC); D602 5(VCC); D603 5(VCC); U600 15(VBUS)* 16(USB_ID)* 19(USB_DP)* 20(USB_DM)*

### Layout directives
differential pair: D1_N, D1_P, D2_N, D2_P, D3_N, D3_P, D4_N, D4_P, D5_N, D5_P, MIPI_DSI_CK_N, MIPI_DSI_CK_P, MIPI_DSI_D0_N, MIPI_DSI_D0_P, MIPI_DSI_D1_N, MIPI_DSI_D1_P, MIPI_DSI_D2_N, MIPI_DSI_D2_P, MIPI_DSI_D3_N, MIPI_DSI_D3_P
differential pair; differential pair class DIFF LVDS 100 OHM; net class LVDS: LVDSCK_N, LVDSCK_P, LVDSTX0_N, LVDSTX0_P, LVDSTX1_N, LVDSTX1_P, LVDSTX2_N, LVDSTX2_P, LVDSTX3_N, LVDSTX3_P
differential pair; differential pair class DIFF HDMI 100 OHM: HDMICK_N, HDMICK_P, HDMITX0_N, HDMITX0_P, HDMITX1_N, HDMITX1_P, HDMITX2_N, HDMITX2_P

### Notes on the sheet
- (01)
- (01,02,04,06,11)
- (01,04,06,07,11)
- LVD&DSI CONNECTOR
- 230mA @1.8V， LT8912
- HDMI CONNECTOR
- Sheet Title:
- Project:
- Inventron
- Electronics and Software
- Size:
- Date:
- Drawn By:
- Revision:
- Checked By:
- A4
- Sheet
- Time:
- of
- Budotek Teknopark
- Dudullu OSB
- Des 2. Cadde No:8/30
- ©2020 Inventron Electronics and Software. All rights reserved.
- Umraniye / ISTANBUL
- (in symbol CON-L-KLS1-285-1-N-1) HDMI Type-A

### Library data of the parts
C600-C604 C623 C625-C627 C629 C631 C633 C637 C640 = CAP-CL05B104KO5NNNC: CAP VER 0.1UF 16V X7R 0402; Manufacturer-1: SAMSUNG; Opt. Temp.: -55/+125; Class: Capacitor; Manufacturer Part Number-1: CL05B104KO5NNNC; Footprint: 0402; Manufacturer-2: *; Manufacturer Part Number-2: *; Inventron Stock No: *; Created By: LA; Created Date: 23.11.2018; Checked By: *; ASSY_OPT: *; Dimensions: *; Unit Price: 0,00499; Revision Date/Note: *; Price Break: 10K
C612 C613 = CAP-CC0402JRNPO9BN180: CAP CER 18PF 50V C0G/NPO 0402; Manufacturer-1: YAGEO; Opt. Temp.: -55/+125; Class: Capacitor; Manufacturer Part Number-1: CC0402JRNPO9BN180; Footprint: 0402; Manufacturer-2: *; Manufacturer Part Number-2: *; Inventron Stock No: *; Created By: LA; Created Date: 23.11.2018; Checked By: *; ASSY_OPT: *; Dimensions: *; Unit Price: 0,00590; Revision Date/Note: *; Price Break: 10K
C620 = CAP-CC0603JRX7R9BB223: CAP CER 0.022UF 50V X7R 0603; Manufacturer-1: YAGEO; Opt. Temp.: -55/+125; Class: Capacitor; Manufacturer Part Number-1: CC0603JRX7R9BB223; Footprint: 0603; Manufacturer-2: *; Manufacturer Part Number-2: *; Inventron Stock No: *; Created By: LA; Created Date: 20.12.2019; Checked By: *; ASSY_OPT: *; Dimensions: *; Unit Price: 0,01961; Revision Date/Note: *; Price Break: 1K
C621 C622 C624 C628 C636 = CAP-JMK107BC6106MA-T: as C501 on sheet 05 MICROSD; Manufacturer Part Number-1: JMK107BC6106MA-T; Footprint: 0603; Manufacturer-2: *; Manufacturer Part Number-2: *; Inventron Stock No: *; Created By: LA; Created Date: 23.11.2018; Checked By: *; ASSY_OPT: *; Dimensions: *; Unit Price: 0,044; Revision Date/Note: *; Price Break: 4K
CON600 = CON-SFV30R-2STBE1HLF: 30 Position FFC, FPC Connector Contacts, Top 0.020" (0.50mm) Surface Mount, Right Angle; Manufacturer-1: Amphenol ICC (FCI); Manufacturer Part Number-1: SFV30R-2STBE1HLF; Footprint: *; Manufacturer-2: *; Manufacturer Part Number-2: *; Inventron Stock No: *; Created By: EE; Created Date: 12.11.2020; Checked By: *; ASSY_OPT: *; Dimensions: *; Unit Price: 0.28455; Revision Date/Note: *; Price Break: 3000; Opt. Temp.: *; Class: Connector; Features: *
CON602 = CON-L-KLS1-285-1-N-1: CONNECTOR SOCKET HDMI SMD 1.4 19PIN / R/A; Manufacturer Part Number-1: L-KLS1-285-1-N-1-R; Manufacturer-1: KLS Electronic(özdisan); Footprint: *; Manufacturer-2: *; Manufacturer Part Number-2: *; Inventron Stock No: *; Created By: E.E; Created Date: 20.10.2020; Checked By: *; ASSY_OPT: *; Dimensions: *; Unit Price: 0.195; Revision Date/Note: *; Price Break: 5000; Opt. Temp.: *; Class: Connector; Features: *
D600 D604 = DIODE-NSR0320MW2T1G: Diode Schottky 1A (DC) Surface Mount SOD-323; Manufacturer-1: ON Semiconductor; Opt. Temp.: -55°C ~ 125°C; Manufacturer Part Number-1: NSR0320MW2T1G; Manufacturer-2: *; Manufacturer Part Number-2: *; Inventron Stock No: *; Created By: E.E; Created Date: 21.10.2020; Checked By: *; ASSY_OPT: *; Dimensions: *; Revision Date/Note: *; Class: Diode
D601-D603 = DIODE-DT1042-04SOQ-7: HDMI TVS DIODE; Manufacturer-1: Diodes Incorporated; Opt. Temp.: -55°C ~ 85°C (TA); Manufacturer Part Number-1: DT1042-04SOQ-7; Footprint: SOT26; Manufacturer-2: *; Manufacturer Part Number-2: *; Inventron Stock No: *; Created By: E.E; Created Date: 23.10.2020; Checked By: *; ASSY_OPT: *; Dimensions: *; Unit Price: 0.07575; Revision Date/Note: *; Price Break: 3000; Class: Diode
L600 L601 L606 = IND-MPZ1608S221ATA00: Power Line Ferrite Bead 0603 (1608 Metric) 2.2A 50mOhmFERRITE BEAD 220 OHM 0603 1LN; Manufacturer Part Number-1: TDK Corporation; Opt. Temp.: -55 TO 125; Class: Inductor; Footprint: 0603; Manufacturer-1: TDK Corporation; Manufacturer-2: *; Manufacturer Part Number-2: *; Inventron Stock No: *; Created By: E.E; Created Date: 28.10.2020; Checked By: *; ASSY_OPT: *; Dimensions: *; Unit Price: 0.02080; Revision Date/Note: *; Price Break: 4000; Features: *
L607 = IND-FERRITE (RES 0 OHM) 0603: as L500 on sheet 05 MICROSD; Footprint: 0603; Manufacturer-2: *; Inventron Stock No: *; Created By: EE; Checked By: *; ASSY_OPT: *; Dimensions: *; Revision Date/Note: *
Q600 = MOS-RU1J002YNTCL: MOSFET N-CH 50V 0.2A UMT3F; Manufacturer-1: ROHM; Opt. Temp.: -55/+150; Class: Transistor; Manufacturer Part Number-1: RU1J002YNTCL; Footprint: SC-85; Manufacturer-2: *; Manufacturer Part Number-2: *; Inventron Stock No: *; Created By: LA; Created Date: 23.11.2018; Checked By: *; ASSY_OPT: *; Dimensions: *; Unit Price: 0,0384; Revision Date/Note: *; Price Break: 3K
Q601 = TRANSISTOR-BC846: TRANS PNP 65V 0.1A SOT-23; Manufacturer Part Number-1: BC846B,215; Manufacturer-1: NXP; Footprint: *; Manufacturer-2: *; Manufacturer Part Number-2: *; Inventron Stock No: *; Created By: LA; Created Date: *; Checked By: *; ASSY_OPT: *; Dimensions: *; Unit Price: 0.02306; Revision Date/Note: *; Price Break: 3000; Opt. Temp.: *; Class: TRANSISTOR
Q602 Q603 = MOS-N-SSM6N37FU,LF: MOSFET DUAL N-CHANNEL 20V 250MA SOT-363; Manufacturer-1: TOSHIBA; Opt. Temp.: -55°C ~ 150°C (TJ); Class: Transistor; Manufacturer Part Number-1: SSM6N37FU,LF; Manufacturer-2: *; Manufacturer Part Number-2: *; Inventron Stock No: *; Created By: OKS; Created Date: 26.05.2022; Checked By: *; ASSY_OPT: *; Dimensions: *; Unit Price: *; Revision Date/Note: *; Price Break: *; Features: *
R600 = RES-RMCF0402FT510K: RES 510K OHM 1% 1/16W 0402; Manufacturer-1: Stackpole Electronics Inc; Class: Resistor; Manufacturer Part Number-1: RMCF0402FT510K; Footprint: *; Manufacturer-2: *; Manufacturer Part Number-2: *; Inventron Stock No: *; Created By: LA; Created Date: *; Checked By: *; ASSY_OPT: *; Dimensions: *; Unit Price: *; Revision Date/Note: *; Price Break: *; Opt. Temp.: *; Tolerance: *
R604-R608 R620 R621 R635-R650 = RES-RMCF0402ZT0R00: RES 0 OHM JUMPER 1/16W 0402; Manufacturer-1: STACKPOLE; Opt. Temp.: -55/+155; Class: Resistor; Manufacturer Part Number-1: RMCF0402ZT0R00; Footprint: 0402; Manufacturer-2: *; Manufacturer Part Number-2: *; Inventron Stock No: *; Created By: LA; Created Date: 23.11.2018; Checked By: *; Dimensions: *; Unit Price: 0,00127; Revision Date/Note: *; Price Break: 10K
  R604 R606 R608 R620 R621 R636 R638 R640 R642 R644 R646 R648 R650: ASSY_OPT: *
R609 R610 = RES-RMCF0402FT3K00: 3 ±1% 0.063W, 1/16W Chip Resistor 0402 (1005 Metric) Automotive AEC-Q200 Thick Film; Manufacturer-1: Stackpole Electronics Inc; Tolerance: 1; Manufacturer Part Number-1: RMCF0402FT3K00; Footprint: 0402; Manufacturer-2: *; Manufacturer Part Number-2: *; Inventron Stock No: *; Created By: E.E; Created Date: 9.11.2020; Checked By: *; ASSY_OPT: *; Dimensions: *; Unit Price: *; Revision Date/Note: *; Price Break: *; Opt. Temp.: *; Class: Resistor
R611 R612 R623 R624 R627 = RES-RMCF0402JT100K: as R514 on sheet 05 MICROSD; Manufacturer Part Number-1: RMCF0402JT100K; Footprint: 0402; Manufacturer-2: *; Manufacturer Part Number-2: *; Inventron Stock No: *; Created By: LA; Created Date: 23.11.2018; Checked By: *; ASSY_OPT: *; Dimensions: *; Unit Price: 0,00127; Revision Date/Note: *; Price Break: 10K; Features: AUTOMOTIVE
R619 R625 R626 R628-R634 = RES-RMCF0402JT10K0: RES 10K OHM 5% 1/16W 0402; Manufacturer-1: STACKPOLE; Opt. Temp.: -55/+155; Class: Resistor; Manufacturer Part Number-1: RMCF0402JT10K0; Footprint: 0402; Manufacturer-2: *; Manufacturer Part Number-2: *; Inventron Stock No: *; Created By: LA; Created Date: 23.11.2018; Checked By: *; ASSY_OPT: *; Dimensions: *; Unit Price: 0,00127; Revision Date/Note: *; Price Break: 10K
U600 = IC-LT8912B: Manufacturer-1: Lontium SemiconductorLontium SemiconductorLontium Semiconductor; Opt. Temp.: −40°C to +85°C; Class: ICs; Manufacturer Part Number-1: LT8912B; Footprint: 64QFN; Manufacturer-2: *; Manufacturer Part Number-2: *; Inventron Stock No: *; Created By: E.E; Created Date: 16.10.2020; Checked By: *; ASSY_OPT: *; Dimensions: *; Unit Price: 2.98; Revision Date/Note: *; Price Break: 1040
U601 = FUSE-0ZCJ0025AF2E: Polymeric PTC Resettable Fuse 24V 250mA Ih Surface Mount 1206 (3216 Metric), Concave; Manufacturer-1: Bel Fuse Inc.; Manufacturer Part Number-1: 0ZCJ0025AF2E; Footprint: 1206; Manufacturer-2: *; Manufacturer Part Number-2: *; Inventron Stock No: *; Created By: EE; Created Date: *; Checked By: *; ASSY_OPT: *; Dimensions: *; Unit Price: 0.0512; Revision Date/Note: *; Price Break: 3000; Opt. Temp.: *; Class: FUSE
XTAL600 = XTAL-TSX-3225 25.0000MF10P-C0: CRYSTAL 25.0000MHZ 18PF SMD; Manufacturer-1: EPSON; Opt. Temp.: +40/+85; Manufacturer Part Number-1: TSX-3225 25.0000MF10P-C0; Footprint: 4-SMD; Manufacturer-2: *; Manufacturer Part Number-2: *; Inventron Stock No: *; Created By: E.E; Created Date: 20.10.2020; Checked By: *; ASSY_OPT: *; Dimensions: *; Unit Price: 0,176; Revision Date/Note: *; Price Break: 2K; Class: Crystal

## Sheet 07 MIPI CSI.SchDoc
size A4
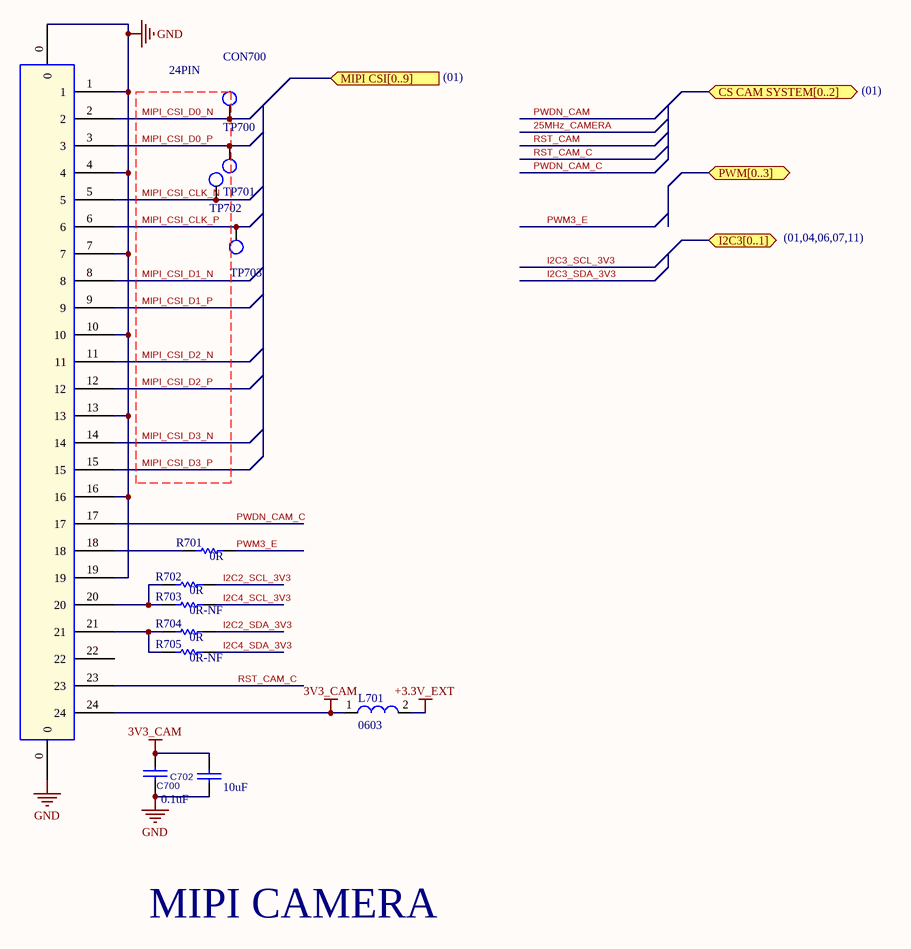
[diagram p6: 07 MIPI CSI.SchDoc]

### Parts
C700  0.1uF  [0402_CC]
C702  10uF  [0603_CC]
CON700  24PIN  [24-PIN FPC]
L701  0603  [0603_RES]
R701  0R  [0402_RES]
R702  0R  [0402_RES]
R703  0R-NF  [0402_RES]  (no BOM)
R704  0R  [0402_RES]
R705  0R-NF  [0402_RES]  (no BOM)
TP700  TEST POINT 15  [testpoint_15]  (value not drawn)  (no BOM)
TP701  TEST POINT 15  [testpoint_15]  (value not drawn)  (no BOM)
TP702  TEST POINT 15  [testpoint_15]  (value not drawn)  (no BOM)
TP703  TEST POINT 15  [testpoint_15]  (value not drawn)  (no BOM)

### Ports
CS CAM SYSTEM[0..2] (bidir), I2C3[0..1] (bidir), MIPI CSI[0..9] (in), PWM[0..3] (bidir)

### Nets
3V3_CAM: C700.1 C702.1 CON700.24 L701.1
+3.3V_EXT: L701.2
GND: C700.2 C702.2 CON700.0 CON700.1 CON700.4 CON700.7 CON700.10 CON700.13 CON700.16 CON700.19
I2C2_SCL_3V3: R702.2
I2C2_SDA_3V3: R704.2
I2C4_SCL_3V3: R703.2
I2C4_SDA_3V3: R705.2
MIPI_CSI_CLK_N: CON700.5 TP702.1
MIPI_CSI_CLK_P: CON700.6 TP703.1
MIPI_CSI_D0_N: CON700.2 TP700.1
MIPI_CSI_D0_P: CON700.3 TP701.1
MIPI_CSI_D1_N: CON700.8
MIPI_CSI_D1_P: CON700.9
MIPI_CSI_D2_N: CON700.11
MIPI_CSI_D2_P: CON700.12
MIPI_CSI_D3_N: CON700.14
MIPI_CSI_D3_P: CON700.15
PWDN_CAM_C: CON700.17
PWM3_E: R701.2
RST_CAM_C: CON700.23
NetCON700_18: CON700.18 R701.1
NetCON700_20: CON700.20 R702.1 R703.1
NetCON700_21: CON700.21 R704.1 R705.1

Not connected (* = marked no-connect by the designer): CON700 22

### Notes on the sheet
- (01)
- (01,04,06,07,11)
- MIPI CAMERA
- Sheet Title:
- Inventron
- Size:
- Drawn By:
- Revision:
- Project:
- Checked By:
- A4
- Sheet
- of
- Budotek Teknopark
- Dudullu OSB
- Des 2. Cadde No:8/30
- Umraniye / ISTANBUL
- Electronics and Software
- Date:
- Time:
- ©2020 Inventron Electronics and Software. All rights reserved.

### Library data of the parts
C700 = CAP-CL05B104KO5NNNC: as C600 on sheet 06 MIPI-DSI to HDMI; Manufacturer Part Number-1: CL05B104KO5NNNC; Footprint: 0402; Manufacturer-2: *; Manufacturer Part Number-2: *; Inventron Stock No: *; Created By: LA; Created Date: 23.11.2018; Checked By: *; ASSY_OPT: *; Dimensions: *; Unit Price: 0,00499; Revision Date/Note: *; Price Break: 10K
C702 = CAP-JMK107BC6106MA-T: as C501 on sheet 05 MICROSD; Manufacturer Part Number-1: JMK107BC6106MA-T; Footprint: 0603; Manufacturer-2: *; Manufacturer Part Number-2: *; Inventron Stock No: *; Created By: LA; Created Date: 23.11.2018; Checked By: *; ASSY_OPT: *; Dimensions: *; Unit Price: 0,044; Revision Date/Note: *; Price Break: 4K
CON700 = CON-SFV24R-4STBE1HLF(GENIS): CONN FPC TOP 24POS 0.50MM R/A; Manufacturer-1: AMPHENOL; Opt. Temp.: -55/+105; Class: Connector; Manufacturer Part Number-1: SFV24R-4STBE1HLF; Footprint: *; Manufacturer-2: *; Manufacturer Part Number-2: *; Inventron Stock No: *; Created By: LA; Created Date: 06.05.2019; Checked By: *; ASSY_OPT: *; Dimensions: *; Unit Price: 0,19575; Revision Date/Note: *; Price Break: 3K
L701 = IND-FERRITE (RES 0 OHM) 0603: as L500 on sheet 05 MICROSD; Footprint: 0603; Manufacturer-2: *; Inventron Stock No: *; Created By: EE; Checked By: *; ASSY_OPT: *; Dimensions: *; Revision Date/Note: *
R701-R705 = RES-RMCF0402ZT0R00: as R604 on sheet 06 MIPI-DSI to HDMI; Manufacturer Part Number-1: RMCF0402ZT0R00; Footprint: 0402; Manufacturer-2: *; Manufacturer Part Number-2: *; Inventron Stock No: *; Created By: LA; Created Date: 23.11.2018; Checked By: *; ASSY_OPT: *; Dimensions: *; Unit Price: 0,00127; Revision Date/Note: *; Price Break: 10K